# Altium schematic sheet LB-word-diffI2C.SchDoc
size A4
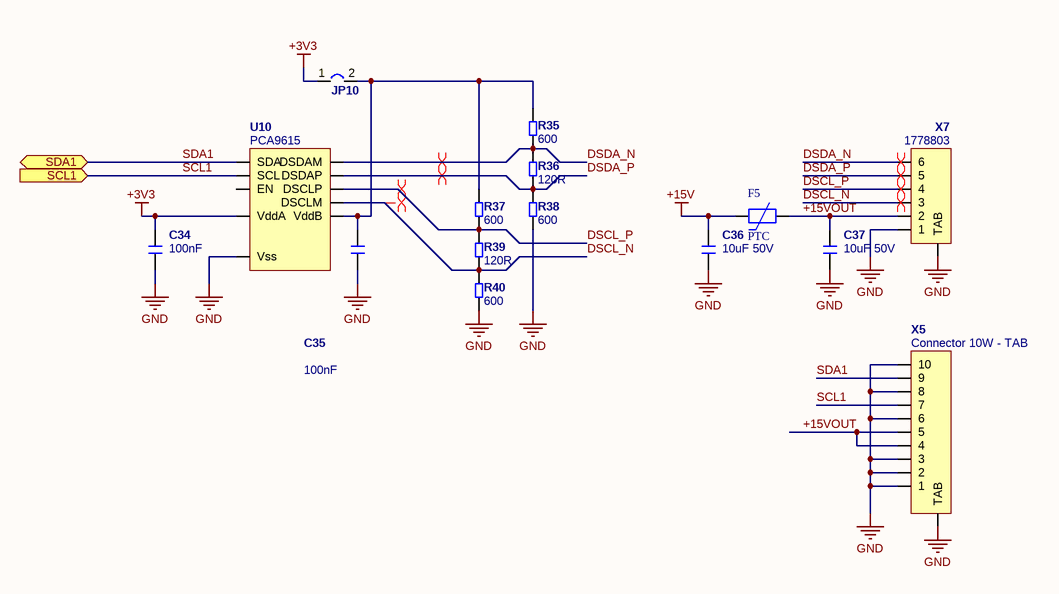
[diagram p0: LB-word-diffI2C.SchDoc]

## Parts
C34  100nF  [C0603_N]
C35  100nF  [C0603_N]
C36  10uF 50V  [C1210_N]
C37  10uF 50V  [C1210_N]
F5  PTC  [1812]
JP10  Jumper 2W  [Jumper SMD 2W NO]  (value not drawn)
R35  600  [R0603]
R36  120R  [R0603]
R37  600  [R0603]
R38  600  [R0603]
R39  120R  [R0603]
R40  600  [R0603]
U10  PCA9615  [TSSOP10]
X5  Connector 10W - TAB  [FPC Conn. 10W 1-84953-0]
X7  1778803  [PTSM-6W-H-SMD]

## Ports
SCL1 (in), SDA1 (bidir)

## Nets
+3V3: C34.1 JP10.1 U10.1(VddA)
+15V: C36.1 F5.1
GND: C34.2 C35.2 C36.2 C37.2 R38.1 R40.1 U10.5(Vss) X5.1 X5.2 X5.3 X5.6 X5.8 X5.10 X5.TAB X7.1 X7.TAB
+15VOUT: C37.1 F5.2 X5.4 X5.5 X7.2
DSCL_N: R39.1 R40.2 U10.6(DSCLM) X7.3
DSCL_P: R37.1 R39.2 U10.7(DSCLP) X7.4
DSDA_N: R35.1 R36.2 U10.9(DSDAM) X7.6
DSDA_P: R36.1 R38.2 U10.8(DSDAP) X7.5
SCL1: U10.4(SCL) X5.7 ; port SCL1
SDA1: U10.2(SDA) X5.9 ; port SDA1
NetC35_1: C35.1 JP10.2 R35.2 R37.2 U10.10(VddB)

Not connected (* = marked no-connect by the designer): U10 3(EN)

## Layout directives
differential pair: DSCL_N, DSCL_P, DSDA_N, DSDA_P

## Library data of the parts
C34-C37 = Capacitor: Capacitor MLCC; Manufacturer: Yageo; Manufacturer Part Number: CC0603KRX7R9BB104; Tolerance (%): 10; Category: Capacitor; Package: 0603; Supplier Part Number 1: 1362556; Supplier 1: Farnell; ComponentLink1URL: http://www.yageo.com; ComponentLink1Description: Manufacturer Website; Voltage Rating (Volts): *; Supplier 2: Digi-Key; Supplier Part Number 2: 311-1344-1-ND
  C34 C35: Value: 100nF
  C36 C37: Value: 10uF 50V
F5 = PTC: PTC, Resettable Fuse
R35-R40 = Resistor: Published: 17-Dec-2003; LatestRevisionDate: 19-Mar-2004; LatestRevisionNote: Silkscreen size reduced.; PackageDocument: Mar-2003; PackageReference: 3-0603; Publisher: Altium Limited; Code_IPC: 1608 [0603]; ComponentLink1Description: Manufacturer Link; ComponentLink1URL: http://www.panasonic.com/industrial/components/resistive_products.htm; ComponentLink2Description: Datasheet; ComponentLink2URL: http://www.panasonic.com/industrial/components/pdf/AOA0000CE2.pdf
  R35 R37 R38 R40: Value: 600
  R36 R39: Value: 120R
U10 = PCA9615DP
X7 = Connector 6W - TAB